# Altium project FE.PrjPcb
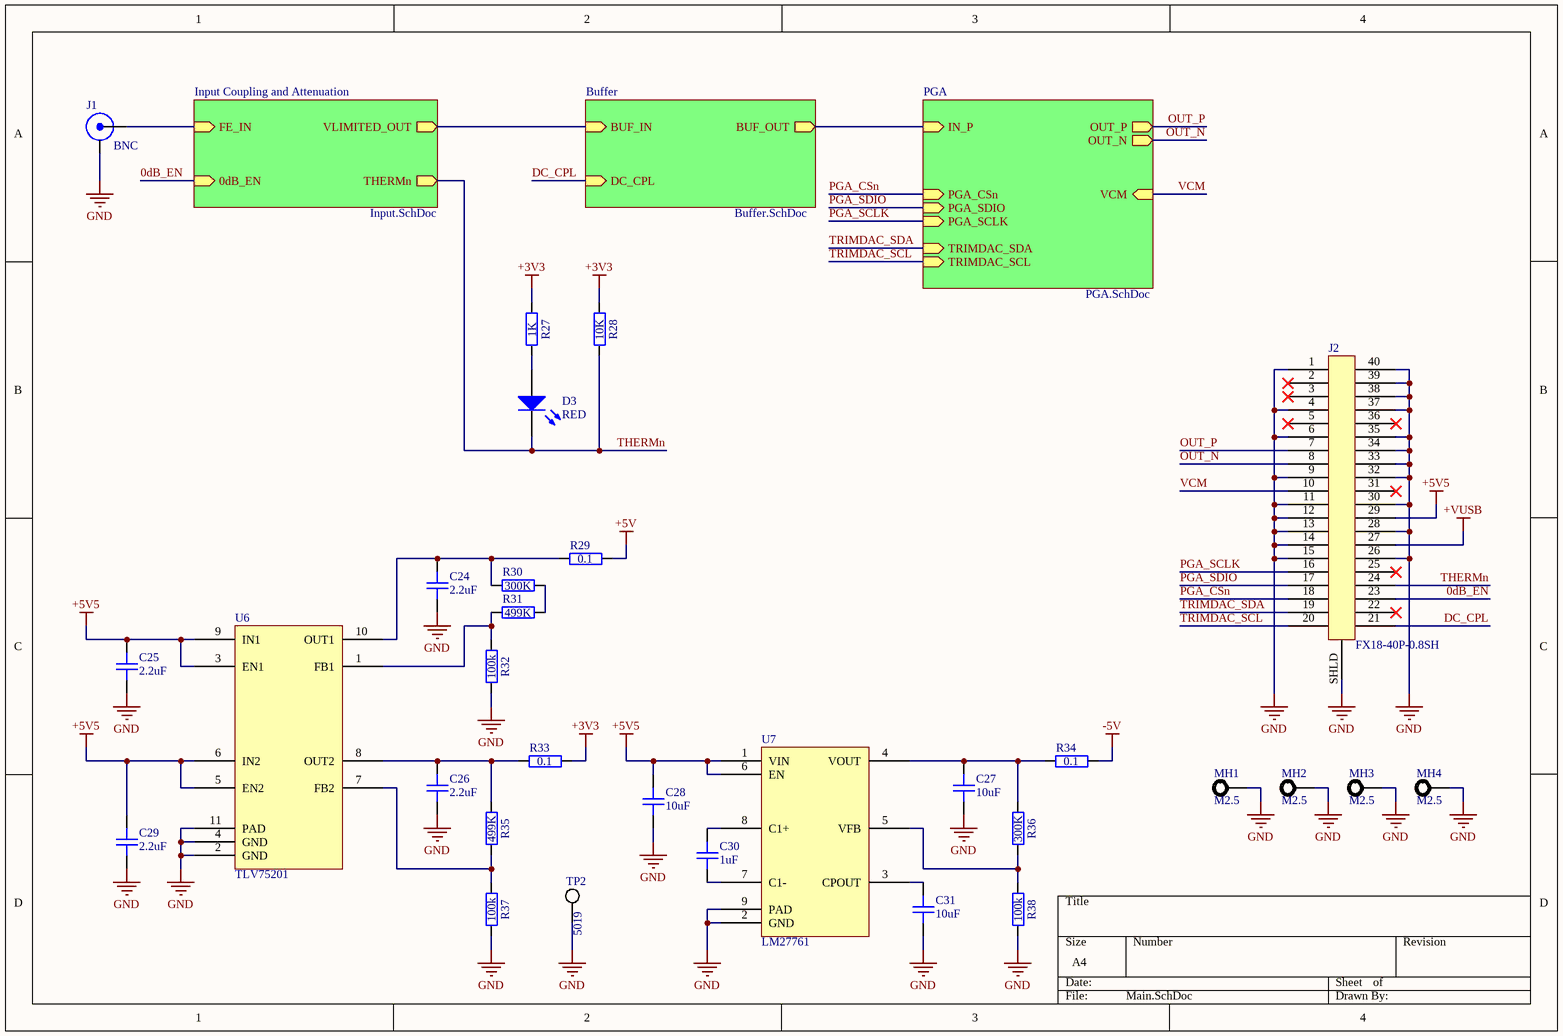
[diagram p0: Main.SchDoc]
4 sheets, 117 parts. Net scope: hierarchical (ports join the sheet entries above them; power ports are global).
Board file: FE.PcbDoc
Sheets:
  Main.SchDoc
    Input Coupling and Attenuation = Input.SchDoc
    Buffer = Buffer.SchDoc
    PGA = PGA.SchDoc

## Sheet Main.SchDoc
size A4

### Parts
C24  value 2.2uF  [GEN_C_0402]  (hidden comment: CAP 2.2uF 10V X5R 0402)
C25  value 2.2uF  [GEN_C_0402]  (hidden comment: CAP 2.2uF 10V X5R 0402)
C26  value 2.2uF  [GEN_C_0402]  (hidden comment: CAP 2.2uF 10V X5R 0402)
C27  value 10uF  [GEN_C_0603]  (hidden comment: CAP 10uF 10V X5R 0603)
C28  value 10uF  [GEN_C_0603]  (hidden comment: CAP 10uF 10V X5R 0603)
C29  value 2.2uF  [GEN_C_0402]  (hidden comment: CAP 2.2uF 10V X5R 0402)
C30  value 1uF  [GEN_C_0402]  (hidden comment: CAP 1uF 25V X5R 0402)
C31  value 10uF  [GEN_C_0603]  (hidden comment: CAP 10uF 10V X5R 0603)
D3  RED  [LED_0603_APT1608]
J1  BNC  [MOL_0731000105]
J2  FX18-40P-0.8SH  [HIR_FX18-40P-0.8SH]
MH1  M2.5  [MH M2.5]  (no BOM)
MH2  M2.5  [MH M2.5]  (no BOM)
MH3  M2.5  [MH M2.5]  (no BOM)
MH4  M2.5  [MH M2.5]  (no BOM)
R27  value 1K  [GEN_R_0402]  (hidden comment: RES 1K OHM 1% 1/10W 0402)
R28  value 10K  [GEN_R_0402]  (hidden comment: RES 10K OHM 1% 1/10W 0402)
R29  0.1  [GEN_R_0402]
R30  value 300K  [GEN_R_0402]  (hidden comment: RES 300K OHM 1% 1/10W 0402)
R31  value 499K  [GEN_R_0402]  (hidden comment: RES 499K OHM 1% 1/10W 0402)
R32  value 100k  [GEN_R_0402]  (hidden comment: RES 100K OHM 1% 1/10W 0402)
R33  0.1  [GEN_R_0402]
R34  0.1  [GEN_R_0402]
R35  value 499K  [GEN_R_0402]  (hidden comment: RES 499K OHM 1% 1/10W 0402)
R36  value 300K  [GEN_R_0402]  (hidden comment: RES 300K OHM 1% 1/10W 0402)
R37  value 100k  [GEN_R_0402]  (hidden comment: RES 100K OHM 1% 1/10W 0402)
R38  value 100k  [GEN_R_0402]  (hidden comment: RES 100K OHM 1% 1/10W 0402)
TP2  5019  [KEY_5019]
U6  TLV75201  [TI_WSON10_DSQ0010A]
U7  LM27761  [TI_WSON8_DSG0008A]

### Sub-sheets
Buffer = Buffer.SchDoc: BUF_IN (in), BUF_OUT (out), DC_CPL (in)
Input Coupling and Attenuation = Input.SchDoc: 0dB_EN (in), FE_IN (in), VLIMITED_OUT (out), THERMn (out)
PGA = PGA.SchDoc: IN_P (in), OUT_N (out), PGA_SDIO (in), OUT_P (out), VCM (in), PGA_SCLK (in), PGA_CSn (in), TRIMDAC_SDA (in), TRIMDAC_SCL (in)

### Nets
+3V3: R27.1 R28.2 R33.2
+5V: R29.2
+5V5: C25.2 C28.2 C29.2 J2.29 U6.3(EN1) U6.5(EN2) U6.6(IN2) U6.9(IN1) U7.1(VIN) U7.6(EN)
+VUSB: J2.27
-5V: R34.2
GND: C24.1 C25.1 C26.1 C27.1 C28.1 C29.1 C31.1 J1.2(SHIELD) J2.1 J2.4 J2.6 J2.9 J2.11 J2.12 J2.13 J2.14 J2.15 J2.26 J2.28 J2.30 J2.32 J2.33 J2.34 J2.35 J2.37 J2.38 J2.39 J2.40 J2.SHLD MH1.1 MH2.1 MH3.1 MH4.1 R32.1 R37.1 R38.1 TP2.1 U6.2(GND) U6.4(GND) U6.11(PAD) U7.2(GND) U7.9(PAD)
0dB_EN: J2.23 ; sheet Input Coupling and Attenuation/0dB_EN
DC_CPL: J2.21 ; sheet Buffer/DC_CPL
OUT_N: J2.8 ; sheet PGA/OUT_N
OUT_P: J2.7 ; sheet PGA/OUT_P
PGA_CSn: J2.18 ; sheet PGA/PGA_CSn
PGA_SCLK: J2.16 ; sheet PGA/PGA_SCLK
PGA_SDIO: J2.17 ; sheet PGA/PGA_SDIO
THERMn: D3.1(K) J2.24 R28.1 ; sheet Input Coupling and Attenuation/THERMn
TRIMDAC_SCL: J2.20 ; sheet PGA/TRIMDAC_SCL
TRIMDAC_SDA: J2.19 ; sheet PGA/TRIMDAC_SDA
VCM: J2.10 ; sheet PGA/VCM
NetC11_2: sheet Input Coupling and Attenuation/VLIMITED_OUT, sheet Buffer/BUF_IN
NetC18_2: J1.1(Signal) ; sheet Input Coupling and Attenuation/FE_IN
NetC24_2: C24.2 R29.1 R30.2 U6.10(OUT1)
NetC26_2: C26.2 R33.1 R35.2 U6.8(OUT2)
NetC27_2: C27.2 R34.1 R36.2 U7.4(VOUT)
NetC30_1: C30.1 U7.7(C1-)
NetC30_2: C30.2 U7.8(C1+)
NetC31_2: C31.2 U7.3(CPOUT)
NetD3_2: D3.2(A) R27.2
NetQ1_2: sheet Buffer/BUF_OUT, sheet PGA/IN_P
NetR30_1: R30.1 R31.1
NetR31_2: R31.2 R32.2 U6.1(FB1)
NetR35_1: R35.1 R37.2 U6.7(FB2)
NetR36_1: R36.1 R38.2 U7.5(VFB)

Not connected (* = marked no-connect by the designer): J2 2* 3* 5* 22* 25* 31* 36*

### Library data of the parts
D3 = LED RED 0603 APT1608: Supplier 1: Digi-Key; Supplier Part Number 1: 754-1930-1-ND
J1 = BNC JACK R/A: Supplier 1: Digi-Key; Supplier Part Number 1: WM5524-ND
J2 = CONN HDR FX18-40P-0.8SH: Supplier 1: Digi-Key; Supplier Part Number 1: H11868-ND
MH1-MH4 = MH M2.5
R27 = RES 1K OHM 1% 1/10W 0402: Power Rating: 0.1W; Tolerance: 1%; Package: 0402; Supplier 1: Digi-Key; Supplier Part Number 1: P1.00KLCT-ND
R28 = RES 10K OHM 1% 1/10W 0402: Power Rating: 0.1W; Tolerance: 1%; Package: 0402; Supplier 1: Digi-Key; Supplier Part Number 1: P10.0KLCT-ND
R29 R33 R34 = RES 0.1 OHM 1% 1/6W 0402: Tolerance: 1%; Power Rating: 0.16W; Package: 0402; Supplier 1: Digi-Key; Supplier Part Number 1: P.10AKCT-ND; Value: 0.1
R30 R36 = RES 300K OHM 1% 1/10W 0402: Power Rating: 0.1W; Tolerance: 1%; Package: 0402; Supplier 1: Digi-Key; Supplier Part Number 1: P300KLCT-ND
R31 R35 = RES 499K OHM 1% 1/10W 0402: Power Rating: 0.1W; Tolerance: 1%; Package: 0402; Supplier 1: Digi-Key; Supplier Part Number 1: P499KLCT-ND
R32 R37 R38 = RES 100K OHM 1% 1/10W 0402: Power Rating: 0.1W; Tolerance: 1%; Package: 0402; Supplier 1: Digi-Key; Supplier Part Number 1: P100KLCT-ND
TP2 = TP KEYSTONE 5019: Supplier 1: Digi-Key; Supplier Part Number 1: 36-5019CT-ND
U6 = IC LDO TLV75201: Supplier 1: Digi-Key; Supplier Part Number 1: 296-TLV75201PDSQRCT-ND
U7 = IC CPUMP LM27761: Supplier 1: Digi-Key; Supplier Part Number 1: 296-44379-1-ND
C24-C26 C29 = CAP 2.2uF 10V X5R 0402: Package: 0402; Voltage Rating: 10V; Supplier 1: Digi-Key; Supplier Part Number 1: 587-3153-1-ND
C27 C28 C31 = CAP 10uF 10V X5R 0603: Package: 0402; Voltage Rating: 10V; Supplier 1: Digi-Key; Supplier Part Number 1: 490-10474-1-ND
C30 = CAP 1uF 25V X5R 0402: Package: 0402; Voltage Rating: 25V; Supplier 1: Digi-Key; Supplier Part Number 1: 490-10017-1-ND

## Sheet Input.SchDoc
size A4
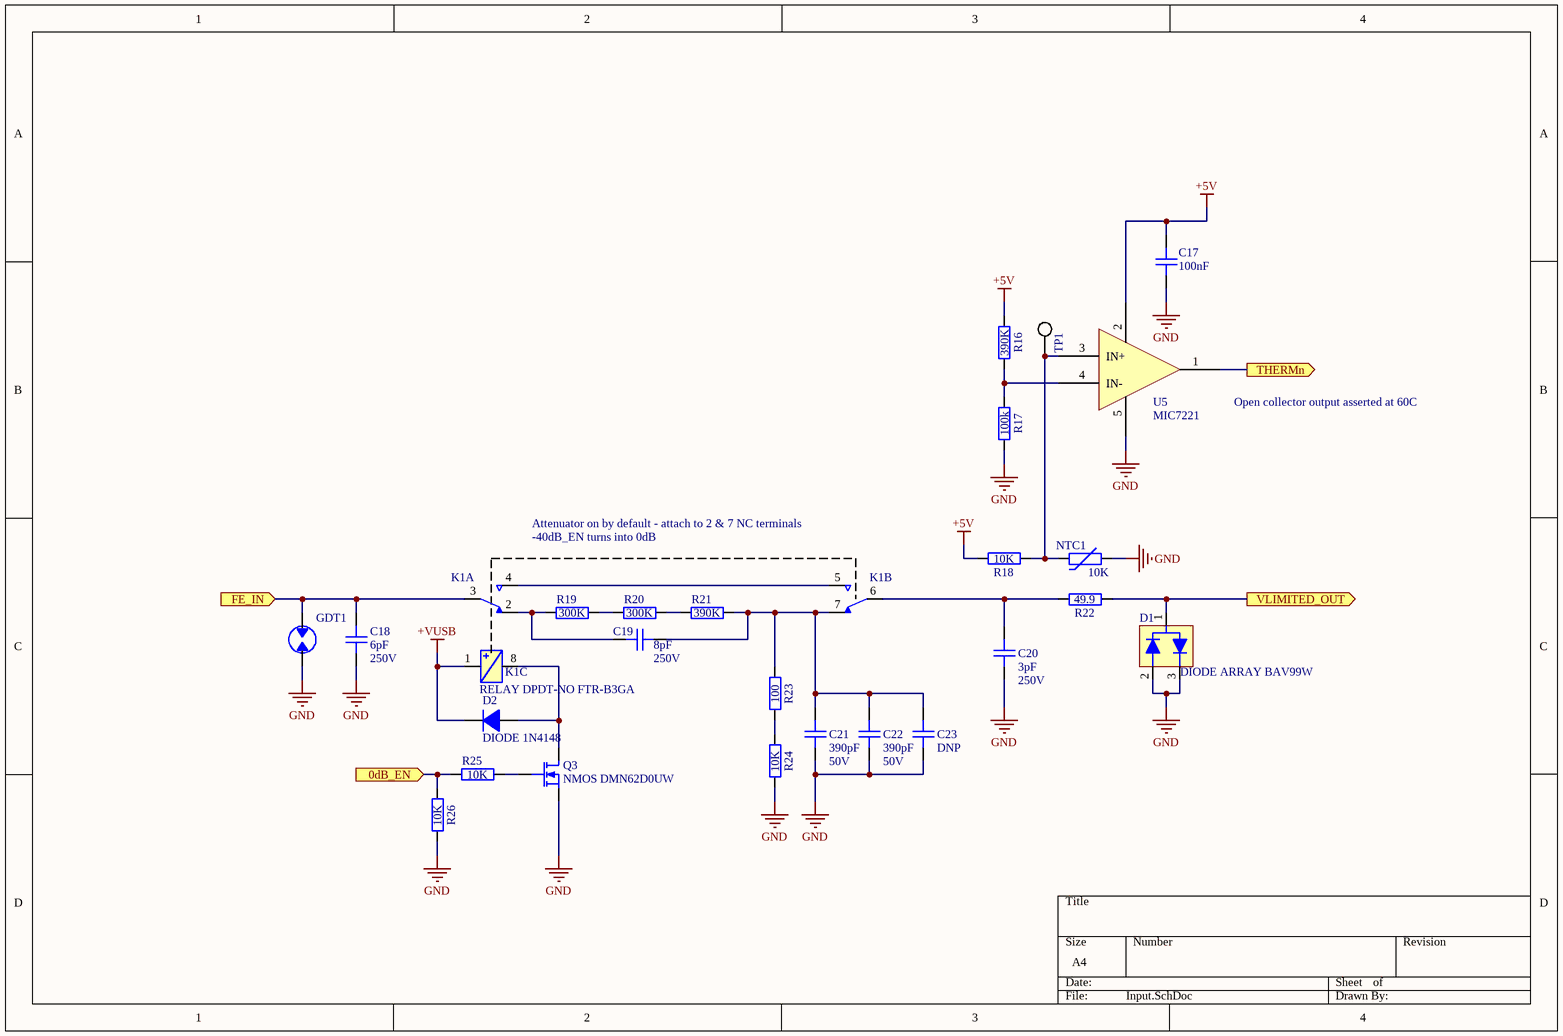
[diagram p1: Input.SchDoc]

### Parts
C17  value 100nF  [GEN_C_0402]  (hidden comment: CAP 100nF 16V X7R 0402)
C18  value 6pF  Voltage Rating: 250V  [GEN_C_0603]  (hidden comment: CAP 6pF 250V C0G 0603)
C19  value 8pF  Voltage Rating: 250V  [GEN_C_0603]  (hidden comment: CAP 8pF 250V C0G 0603)
C20  value 3pF  Voltage Rating: 250V  [GEN_C_0603]  (hidden comment: CAP 3pF 250V C0G 0603)
C21  value 390pF  Voltage Rating: 50V  [GEN_C_0402]  (hidden comment: CAP 390pF 50V C0G 0402)
C22  value 390pF  Voltage Rating: 50V  [GEN_C_0402]  (hidden comment: CAP 390pF 50V C0G 0402)
C23  value DNP  [GEN_C_0402]  (hidden comment: CAP DNP 0402)
D1  DIODE ARRAY BAV99W  [GEN_SOT_323]
D2  DIODE 1N4148  [GEN_SOD_323]
GDT1  GDT 90V  [BOU_2051]  (value not drawn)
K1  RELAY DPDT-NO FTR-B3GA  [FUJ_FTR-B3GA]  (value not drawn)  (parts A,B,C of 3)
NTC1  value 10K  [GEN_R_0402]  (hidden comment: NTC 10K 3900K 0402)
Q3  NMOS DMN62D0UW  [GEN_SOT_323]
R16  value 390K  [GEN_R_0402]  (hidden comment: RES 390K OHM 1% 1/10W 0402)
R17  value 100k  [GEN_R_0402]  (hidden comment: RES 100K OHM 1% 1/10W 0402)
R18  value 10K  [GEN_R_0402]  (hidden comment: RES 10K OHM 1% 1/10W 0402)
R19  value 300K  [GEN_R_0402]  (hidden comment: RES 300K OHM 1% 1/10W 0402)
R20  value 300K  [GEN_R_0402]  (hidden comment: RES 300K OHM 1% 1/10W 0402)
R21  value 390K  [GEN_R_0402]  (hidden comment: RES 390K OHM 1% 1/10W 0402)
R22  49.9  [GEN_R_0402]
R23  value 100  [GEN_R_0402]  (hidden comment: RES 100 OHM 1% 1/10W 0402)
R24  value 10K  [GEN_R_0402]  (hidden comment: RES 10K OHM 1% 1/10W 0402)
R25  value 10K  [GEN_R_0402]  (hidden comment: RES 10K OHM 1% 1/10W 0402)
R26  value 10K  [GEN_R_0402]  (hidden comment: RES 10K OHM 1% 1/10W 0402)
TP1  5019  [KEY_5019]  (value not drawn)
U5  MIC7221  [GEN_SOT23_5_950_2900X1600X1450]

### Ports
0dB_EN (in), FE_IN (in), THERMn (out), VLIMITED_OUT (out)

### Nets
+5V: C17.1 R16.1 R18.2 U5.2(V+)
+VUSB: D2.1(K) K1.1
GND: C17.2 C18.1 C20.2 C21.1 C22.1 C23.1 D1.2 D1.3 GDT1.2 NTC1.2 Q3.3(S) R17.2 R24.1 R26.1 U5.5(V-)
0dB_EN: R25.2 R26.2 ; port 0dB_EN
THERMn: U5.1(OUT) ; port THERMn
NetC11_2: D1.1 R22.2 ; port VLIMITED_OUT
NetC18_2: C18.2 GDT1.1 K1.3 ; port FE_IN
NetC19_1: C19.1 C21.2 C22.2 C23.2 K1.7 R21.2 R23.2
NetC19_2: C19.2 K1.2 R19.1
NetC20_1: C20.1 K1.6 R22.1
NetD2_2: D2.2(A) K1.8 Q3.1(D)
NetK1_4: K1.4 K1.5
NetNTC1_1: NTC1.1 R18.1 TP1.1 U5.3(IN+)
NetQ3_2: Q3.2(G) R25.1
NetR16_2: R16.2 R17.1 U5.4(IN-)
NetR19_2: R19.2 R20.1
NetR20_2: R20.2 R21.1
NetR23_1: R23.1 R24.2

### Notes on the sheet
- Open collector output asserted at 60C
- Attenuator on by default - attach to 2 & 7 NC terminals
- -40dB_EN turns into 0dB

### Library data of the parts
D2 = DIODE 1N4148: Max Reverse Voltage: 75V; Max Current: 150mA; Supplier 1: Digi-Key; Supplier Part Number 1: 1N4148WS-FDICT-ND
Q3 = NMOS DMN62D0UW: Vdss: 60V; Id: 340mA; Max Power: 320mW; Supplier 1: Digi-Key; Supplier Part Number 1: DMN62D0UW-7DICT-ND
R16 R21 = RES 390K OHM 1% 1/10W 0402: Power Rating: 0.1W; Tolerance: 1%; Package: 0402; Supplier 1: Digi-Key; Supplier Part Number 1: P390KLCT-ND
R17 = RES 100K OHM 1% 1/10W 0402: Power Rating: 0.1W; Tolerance: 1%; Package: 0402; Supplier 1: Digi-Key; Supplier Part Number 1: P100KLCT-ND
R18 R24-R26 = RES 10K OHM 1% 1/10W 0402: Power Rating: 0.1W; Tolerance: 1%; Package: 0402; Supplier 1: Digi-Key; Supplier Part Number 1: P10.0KLCT-ND
R19 R20 = RES 300K OHM 1% 1/10W 0402: Power Rating: 0.1W; Tolerance: 1%; Package: 0402; Supplier 1: Digi-Key; Supplier Part Number 1: P300KLCT-ND
R22 = RES 49.9 OHM 1% 1/10W 0402: Tolerance: 1%; Power Rating: 0.1W; Package: 0402; Supplier 1: Digi-Key; Supplier Part Number 1: P49.9LCT-ND; Value: 49.9
R23 = RES 100 OHM 1% 1/10W 0402: Power Rating: 0.1W; Tolerance: 1%; Package: 0402; Supplier 1: Digi-Key; Supplier Part Number 1: P100LCT-ND
TP1 = TP KEYSTONE 5019: Supplier 1: Digi-Key; Supplier Part Number 1: 36-5019CT-ND
U5 = IC COMP MIC7221YM5: Supplier 1: Digi-Key; Supplier Part Number 1: 576-2901-1-ND
C17 = CAP 100nF 16V X7R 0402: Package: 0402; Voltage Rating: 16V; Supplier 1: Digi-Key; Supplier Part Number 1: 490-4759-1-ND
C18 = CAP 6pF 250V C0G 0603: Supplier 1: Digi-Key; Supplier Part Number 1: 399-8734-1-ND; Package: 0603
C19 = CAP 8pF 250V C0G 0603: Package: 0603; Supplier 1: Digi-Key; Supplier Part Number 1: 399-8740-1-ND
C20 = CAP 3pF 250V C0G 0603: Package: 0603; Supplier 1: Digi-Key; Supplier Part Number 1: 399-8820-1-ND
C21 C22 = CAP 390pF 50V C0G 0402: Package: 0402; Supplier 1: Digi-Key; Supplier Part Number 1: 490-8202-1-ND
C23 = CAP DNP 0402: Package: 0402
D1 = DIODE ARRAY BAV99W: Supplier 1: Digi-Key; Supplier Part Number 1: BAV99W-FDICT-ND
GDT1 = GDT 90V: Supplier 1: Digi-Key; Supplier Part Number 1: 2051-09-SM-RPLFCT-ND
NTC1 = NTC 10K 3900K 0402: Package: 0402; B Value: 3900k; Supplier 1: Digi-Key; Supplier Part Number 1: P12985CT-ND

## Sheet Buffer.SchDoc
size A4
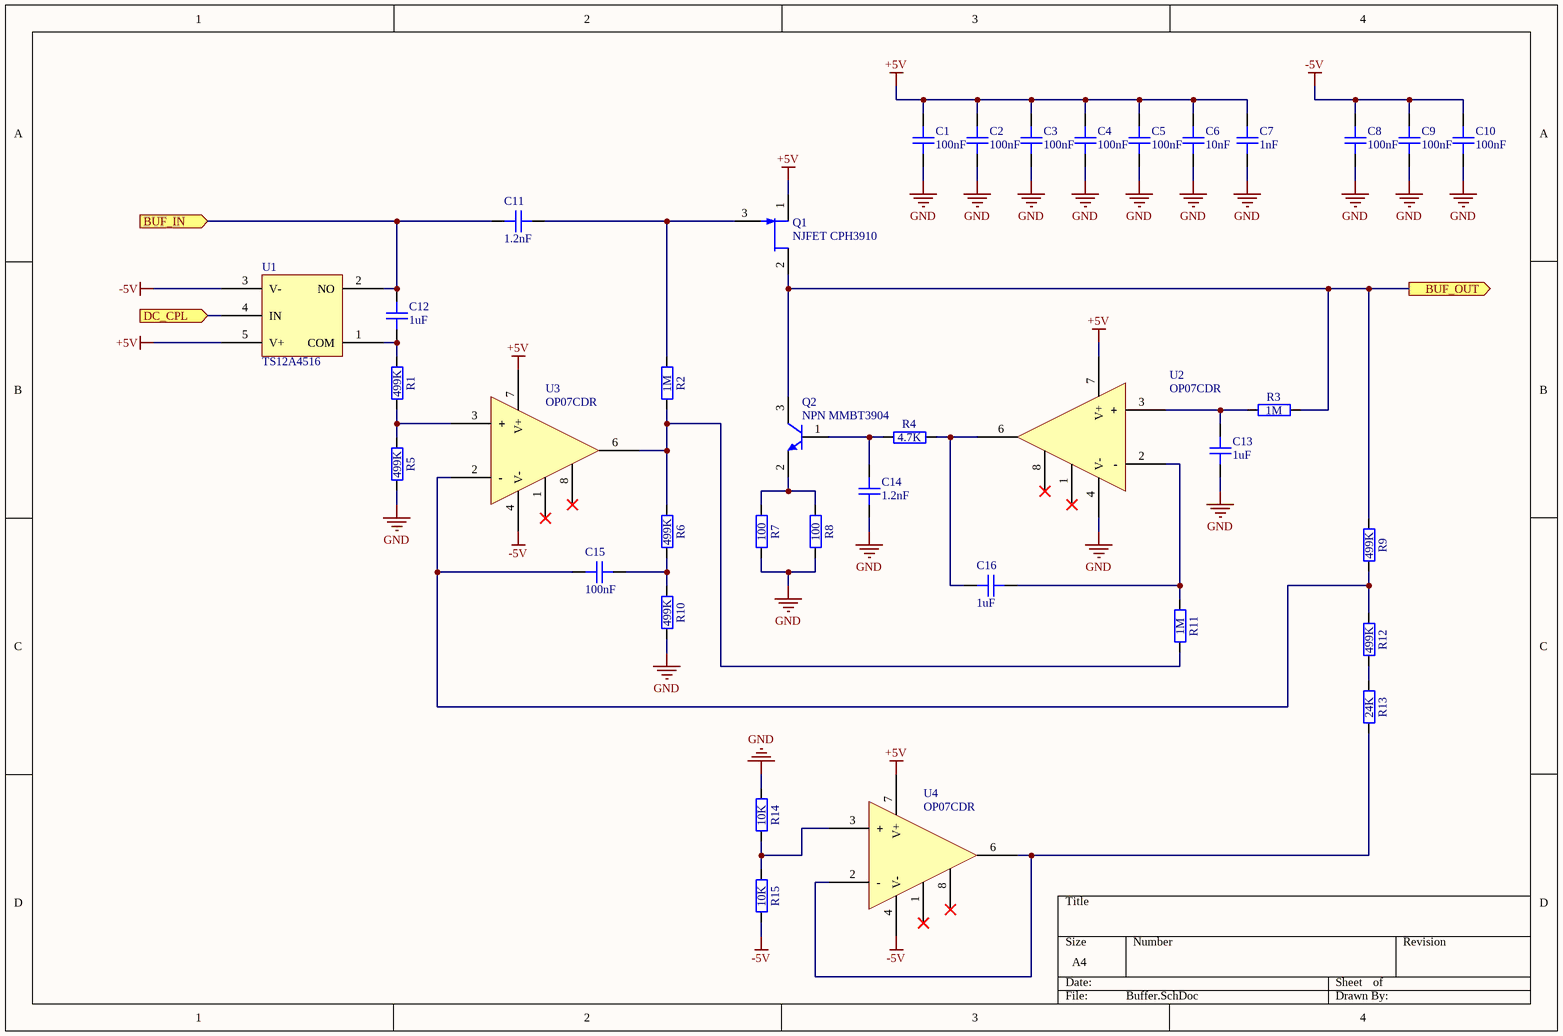
[diagram p2: Buffer.SchDoc]

### Parts
C1  value 100nF  [GEN_C_0402]  (hidden comment: CAP 100nF 16V X7R 0402)
C2  value 100nF  [GEN_C_0402]  (hidden comment: CAP 100nF 16V X7R 0402)
C3  value 100nF  [GEN_C_0402]  (hidden comment: CAP 100nF 16V X7R 0402)
C4  value 100nF  [GEN_C_0402]  (hidden comment: CAP 100nF 16V X7R 0402)
C5  value 100nF  [GEN_C_0402]  (hidden comment: CAP 100nF 16V X7R 0402)
C6  value 10nF  [GEN_C_0402]  (hidden comment: CAP 10nF 50V X7R 0402)
C7  value 1nF  [GEN_C_0402]  (hidden comment: CAP 1nF 50V X7R 0402)
C8  value 100nF  [GEN_C_0402]  (hidden comment: CAP 100nF 16V X7R 0402)
C9  value 100nF  [GEN_C_0402]  (hidden comment: CAP 100nF 16V X7R 0402)
C10  value 100nF  [GEN_C_0402]  (hidden comment: CAP 100nF 16V X7R 0402)
C11  1.2nF  [GEN_C_0603]
C12  value 1uF  [GEN_C_0402]  (hidden comment: CAP 1uF 25V X5R 0402)
C13  value 1uF  [GEN_C_0402]  (hidden comment: CAP 1uF 25V X5R 0402)
C14  1.2nF  [GEN_C_0603]
C15  value 100nF  [GEN_C_0402]  (hidden comment: CAP 100nF 16V X7R 0402)
C16  value 1uF  [GEN_C_0402]  (hidden comment: CAP 1uF 25V X5R 0402)
Q1  NJFET CPH3910  [ON_SOT23_CPH3]
Q2  NPN MMBT3904  [MMC_SOT23]
R1  value 499K  [GEN_R_0402]  (hidden comment: RES 499K OHM 1% 1/10W 0402)
R2  value 1M  [GEN_R_0402]  (hidden comment: RES 1M OHM 1% 1/10W 0402)
R3  value 1M  [GEN_R_0402]  (hidden comment: RES 1M OHM 1% 1/10W 0402)
R4  value 4.7K  [GEN_R_0402]  (hidden comment: RES 4.7K OHM 1% 1/10W 0402)
R5  value 499K  [GEN_R_0402]  (hidden comment: RES 499K OHM 1% 1/10W 0402)
R6  value 499K  [GEN_R_0402]  (hidden comment: RES 499K OHM 1% 1/10W 0402)
R7  value 100  [GEN_R_0402]  (hidden comment: RES 100 OHM 1% 1/10W 0402)
R8  value 100  [GEN_R_0402]  (hidden comment: RES 100 OHM 1% 1/10W 0402)
R9  value 499K  [GEN_R_0402]  (hidden comment: RES 499K OHM 1% 1/10W 0402)
R10  value 499K  [GEN_R_0402]  (hidden comment: RES 499K OHM 1% 1/10W 0402)
R11  value 1M  [GEN_R_0402]  (hidden comment: RES 1M OHM 1% 1/10W 0402)
R12  value 499K  [GEN_R_0402]  (hidden comment: RES 499K OHM 1% 1/10W 0402)
R13  value 24K  [GEN_R_0402]  (hidden comment: RES 24K OHM 1% 1/10W 0402)
R14  value 10K  [GEN_R_0402]  (hidden comment: RES 10K OHM 1% 1/10W 0402)
R15  value 10K  [GEN_R_0402]  (hidden comment: RES 10K OHM 1% 1/10W 0402)
U1  TS12A4516  [GEN_SOT23_5_950_2900X1600X1450]
U2  OP07CDR  [TI_SOIC8_D0008A]
U3  OP07CDR  [TI_SOIC8_D0008A]
U4  OP07CDR  [TI_SOIC8_D0008A]

### Ports
BUF_IN (in), BUF_OUT (out), DC_CPL (in)

### Nets
+5V: C1.1 C2.1 C3.1 C4.1 C5.1 C6.2 C7.2 Q1.1(S) U1.5(V+) U2.7(V+) U3.7(V+) U4.7(V+)
-5V: C8.1 C9.1 C10.1 R15.1 U1.3(V-) U3.4(V-) U4.4(V-)
GND: C1.2 C2.2 C3.2 C4.2 C5.2 C6.1 C7.1 C8.2 C9.2 C10.2 C13.1 C14.1 R5.1 R7.1 R8.1 R10.1 R14.2 U2.4(V-)
DC_CPL: U1.4(IN) ; port DC_CPL
NetC11_1: C11.1 Q1.3(G) R2.2
NetC11_2: C11.2 C12.2 U1.2(NO) ; port BUF_IN
NetC12_1: C12.1 R1.2 U1.1(COM)
NetC13_2: C13.2 R3.2 U2.3(+)
NetC14_2: C14.2 Q2.1(B) R4.1
NetC15_1: C15.1 R6.1 R10.2
NetC15_2: C15.2 R9.1 R12.2 U3.2(-)
NetC16_1: C16.1 R11.2 U2.2(-)
NetC16_2: C16.2 R4.2 U2.6(OUT)
NetQ1_2: Q1.2(D) Q2.3(C) R3.1 R9.2 ; port BUF_OUT
NetQ2_2: Q2.2(E) R7.2 R8.2
NetR1_1: R1.1 R5.2 U3.3(+)
NetR2_1: R2.1 R6.2 R11.1 U3.6(OUT)
NetR12_1: R12.1 R13.2
NetR13_1: R13.1 U4.2(-) U4.6(OUT)
NetR14_1: R14.1 R15.2 U4.3(+)

Not connected (* = marked no-connect by the designer): U2 1(N1)* 8(N2)*; U3 1(N1)* 8(N2)*; U4 1(N1)* 8(N2)*

### Library data of the parts
C11 C14 = CAP 1.2nF 50V C0G 0603: Voltage Rating: 50V; Temperature Coefficient: C0G; Package: 0603; Value: 1.2nF; Supplier 1: Digi-Key; Supplier Part Number 1: 490-1453-1-ND
R1 R5 R6 R9 R10 R12 = RES 499K OHM 1% 1/10W 0402: Power Rating: 0.1W; Tolerance: 1%; Package: 0402; Supplier 1: Digi-Key; Supplier Part Number 1: P499KLCT-ND
R2 R3 R11 = RES 1M OHM 1% 1/10W 0402: Power Rating: 0.1W; Tolerance: 1%; Package: 0402; Supplier 1: Digi-Key; Supplier Part Number 1: P1.00MLCT-ND
R4 = RES 4.7K OHM 1% 1/10W 0402: Power Rating: 0.1W; Tolerance: 1%; Package: 0402; Supplier 1: Digi-Key; Supplier Part Number 1: P4.70KLCT-ND
R7 R8 = RES 100 OHM 1% 1/10W 0402: Power Rating: 0.1W; Tolerance: 1%; Package: 0402; Supplier 1: Digi-Key; Supplier Part Number 1: P100LCT-ND
R13 = RES 24K OHM 1% 1/10W 0402: Power Rating: 0.1W; Tolerance: 1%; Package: 0402; Supplier 1: Digi-Key; Supplier Part Number 1: P24.0KLCT-ND
R14 R15 = RES 10K OHM 1% 1/10W 0402: Power Rating: 0.1W; Tolerance: 1%; Package: 0402; Supplier 1: Digi-Key; Supplier Part Number 1: P10.0KLCT-ND
U1 = IC SWITCH SPST TS12A4516DBVR: Supplier 1: Digi-Key; Supplier Part Number 1: 296-24269-1-ND
U2-U4 = IC OPAMP OP07CDR: Supplier 1: Digi-Key; Supplier Part Number 1: 296-14626-1-ND
C1-C5 C8-C10 C15 = CAP 100nF 16V X7R 0402: Package: 0402; Voltage Rating: 16V; Supplier 1: Digi-Key; Supplier Part Number 1: 490-4759-1-ND
C6 = CAP 10nF 50V X7R 0402: Package: 0402; Voltage Rating: 50V; Supplier 1: Digi-Key; Supplier Part Number 1: 490-4762-1-ND
C7 = CAP 1nF 50V X7R 0402: Package: 0402; Voltage Rating: 50V; Supplier 1: Digi-Key; Supplier Part Number 1: 490-4761-1-ND
C12 C13 C16 = CAP 1uF 25V X5R 0402: Package: 0402; Voltage Rating: 25V; Supplier 1: Digi-Key; Supplier Part Number 1: 490-10017-1-ND
Q1 = NJFET CPH3910: Supplier 1: Digi-Key; Supplier Part Number 1: CPH3910-TL-EOSCT-ND
Q2 = NPN MMBT3904: Supplier 1: Digi-Key; Supplier Part Number 1: MMBT3904TPMSCT-ND

## Sheet PGA.SchDoc
size A4
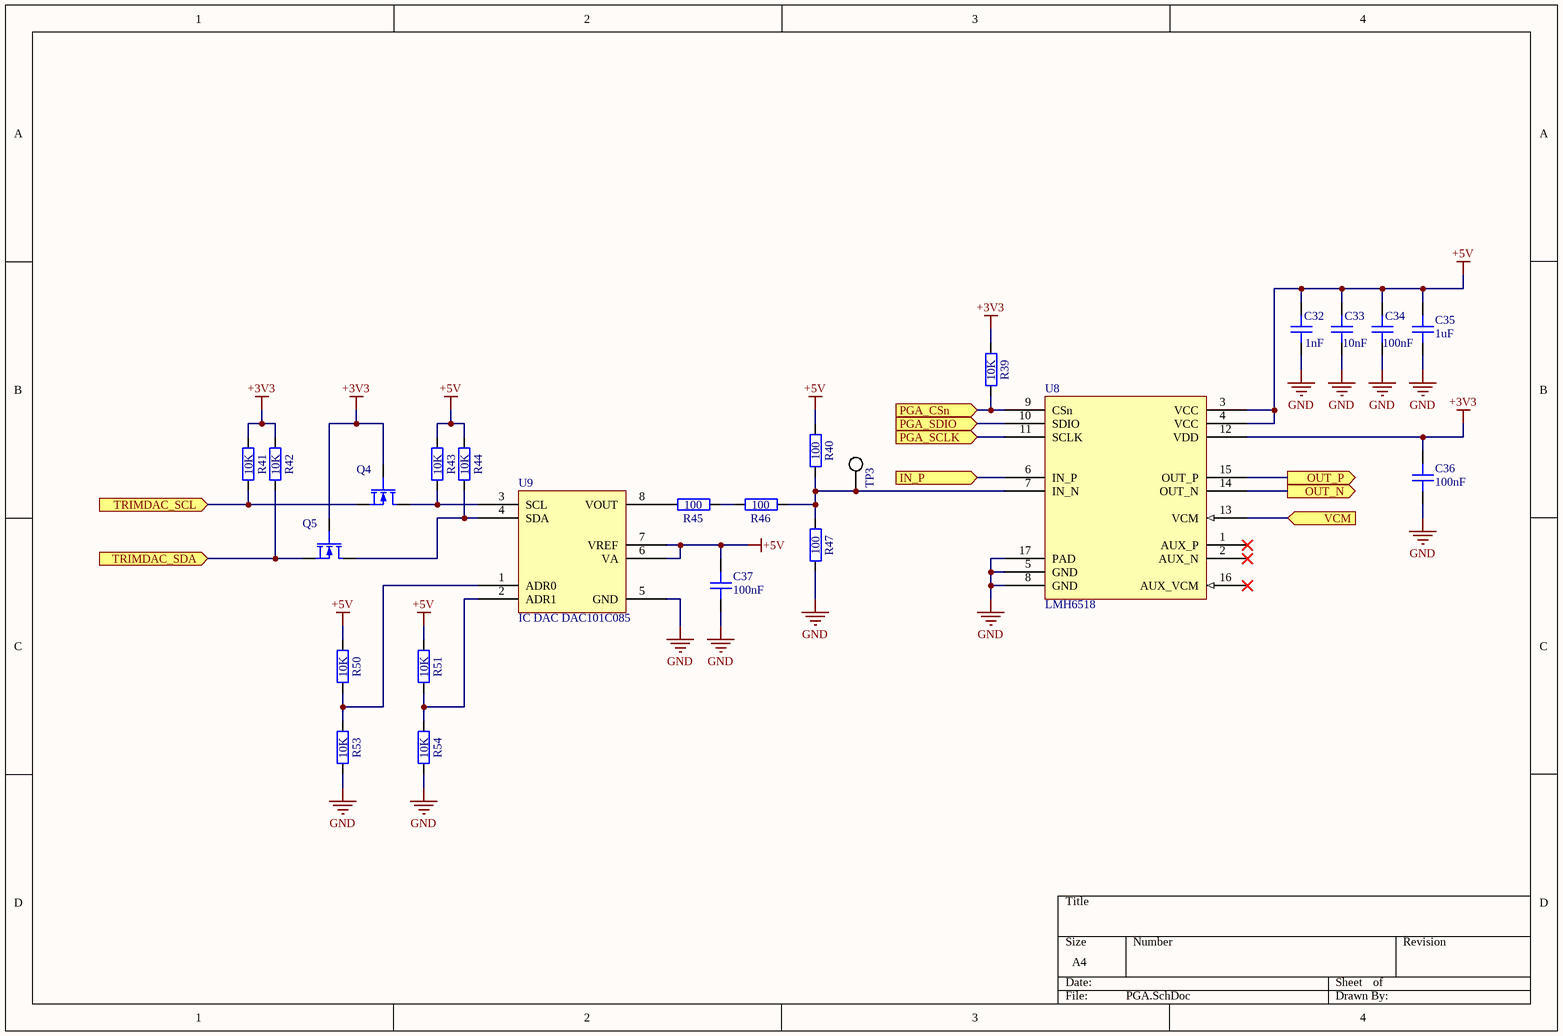
[diagram p3: PGA.SchDoc]

### Parts
C32  value 1nF  [GEN_C_0402]  (hidden comment: CAP 1nF 50V X7R 0402)
C33  value 10nF  [GEN_C_0402]  (hidden comment: CAP 10nF 50V X7R 0402)
C34  value 100nF  [GEN_C_0402]  (hidden comment: CAP 100nF 16V X7R 0402)
C35  value 1uF  [GEN_C_0402]  (hidden comment: CAP 1uF 25V X5R 0402)
C36  value 100nF  [GEN_C_0402]  (hidden comment: CAP 100nF 16V X7R 0402)
C37  value 100nF  [GEN_C_0402]  (hidden comment: CAP 100nF 16V X7R 0402)
Q4  NMOS DMN62D0UW  [GEN_SOT_323]  (value not drawn)
Q5  NMOS DMN62D0UW  [GEN_SOT_323]  (value not drawn)
R39  value 10K  [GEN_R_0402]  (hidden comment: RES 10K OHM 1% 1/10W 0402)
R40  value 100  [GEN_R_0402]  (hidden comment: RES 100 OHM 1% 1/10W 0402)
R41  value 10K  [GEN_R_0402]  (hidden comment: RES 10K OHM 1% 1/10W 0402)
R42  value 10K  [GEN_R_0402]  (hidden comment: RES 10K OHM 1% 1/10W 0402)
R43  value 10K  [GEN_R_0402]  (hidden comment: RES 10K OHM 1% 1/10W 0402)
R44  value 10K  [GEN_R_0402]  (hidden comment: RES 10K OHM 1% 1/10W 0402)
R45  value 100  [GEN_R_0402]  (hidden comment: RES 100 OHM 1% 1/10W 0402)
R46  value 100  [GEN_R_0402]  (hidden comment: RES 100 OHM 1% 1/10W 0402)
R47  value 100  [GEN_R_0402]  (hidden comment: RES 100 OHM 1% 1/10W 0402)
R50  value 10K  [GEN_R_0402]  (hidden comment: RES 10K OHM 1% 1/10W 0402)
R51  value 10K  [GEN_R_0402]  (hidden comment: RES 10K OHM 1% 1/10W 0402)
R53  value 10K  [GEN_R_0402]  (hidden comment: RES 10K OHM 1% 1/10W 0402)
R54  value 10K  [GEN_R_0402]  (hidden comment: RES 10K OHM 1% 1/10W 0402)
TP3  5019  [KEY_5019]  (value not drawn)
U8  LMH6518  [TI_WQFN_RGH0016A]
U9  IC DAC DAC101C085  [TI_VSSOP8_DGK]

### Ports
IN_P (in), OUT_N (out), OUT_P (out), PGA_CSn (in), PGA_SCLK (in), PGA_SDIO (in), TRIMDAC_SCL (in), TRIMDAC_SDA (in), VCM (in)

### Nets
+3V3: C36.2 Q4.2(G) Q5.2(G) R39.2 R41.2 R42.2 U8.12(VDD)
+5V: C32.2 C33.2 C34.2 C35.2 C37.2 R40.2 R43.2 R44.2 R50.2 R51.2 U8.3(VCC) U8.4(VCC) U9.6(VA) U9.7(VREF)
GND: C32.1 C33.1 C34.1 C35.1 C36.1 C37.1 R47.1 R53.1 R54.1 U8.5(GND) U8.8(GND) U8.17(PAD) U9.5(GND)
OUT_N: U8.14(OUT_N) ; port OUT_N
OUT_P: U8.15(OUT_P) ; port OUT_P
PGA_CSn: R39.1 U8.9(CSn) ; port PGA_CSn
PGA_SCLK: U8.11(SCLK) ; port PGA_SCLK
PGA_SDIO: U8.10(SDIO) ; port PGA_SDIO
TRIMDAC_SCL: Q4.3(S) R41.1 ; port TRIMDAC_SCL
TRIMDAC_SDA: Q5.3(S) R42.1 ; port TRIMDAC_SDA
VCM: U8.13(VCM) ; port VCM
NetQ1_2: U8.6(IN_P) ; port IN_P
NetQ4_1: Q4.1(D) R43.1 U9.3(SCL)
NetQ5_1: Q5.1(D) R44.1 U9.4(SDA)
NetR40_1: R40.1 R46.1 R47.2 TP3.1 U8.7(IN_N)
NetR45_1: R45.1 R46.2
NetR45_2: R45.2 U9.8(VOUT)
NetR50_1: R50.1 R53.2 U9.1(ADR0)
NetR51_1: R51.1 R54.2 U9.2(ADR1)

Not connected (* = marked no-connect by the designer): U8 1(AUX_P)* 2(AUX_N)* 16(AUX_VCM)*

### Library data of the parts
Q4 Q5 = NMOS DMN62D0UW: Vdss: 60V; Id: 340mA; Max Power: 320mW; Supplier 1: Digi-Key; Supplier Part Number 1: DMN62D0UW-7DICT-ND
R39 R41-R44 R50 R51 R53 R54 = RES 10K OHM 1% 1/10W 0402: Power Rating: 0.1W; Tolerance: 1%; Package: 0402; Supplier 1: Digi-Key; Supplier Part Number 1: P10.0KLCT-ND
R40 R45-R47 = RES 100 OHM 1% 1/10W 0402: Power Rating: 0.1W; Tolerance: 1%; Package: 0402; Supplier 1: Digi-Key; Supplier Part Number 1: P100LCT-ND
TP3 = TP KEYSTONE 5019: Supplier 1: Digi-Key; Supplier Part Number 1: 36-5019CT-ND
U8 = IC PGA LMH6518: Supplier 1: Digi-Key; Supplier Part Number 1: LMH6518SQE/NOPBCT-ND
C32 = CAP 1nF 50V X7R 0402: Package: 0402; Voltage Rating: 50V; Supplier 1: Digi-Key; Supplier Part Number 1: 490-4761-1-ND
C33 = CAP 10nF 50V X7R 0402: Package: 0402; Voltage Rating: 50V; Supplier 1: Digi-Key; Supplier Part Number 1: 490-4762-1-ND
C34 C36 C37 = CAP 100nF 16V X7R 0402: Package: 0402; Voltage Rating: 16V; Supplier 1: Digi-Key; Supplier Part Number 1: 490-4759-1-ND
C35 = CAP 1uF 25V X5R 0402: Package: 0402; Voltage Rating: 25V; Supplier 1: Digi-Key; Supplier Part Number 1: 490-10017-1-ND
U9 = IC DAC DAC101C085: Supplier 1: Digi-Key; Supplier Part Number 1: DAC101C085CIMM/NOPBCT-ND

## Nets that join several sheets
+3V3: Main (R27.1 R28.2 R33.2), PGA (7 pins)
+5V: Main (R29.2), Input (C17.1 R16.1 R18.2 U5.2), Buffer (12 pins), PGA (14 pins)
+VUSB: Main (J2.27), Input (D2.1 K1.1)
-5V: Main (R34.2), Buffer (7 pins)
GND: Main (42 pins), Input (15 pins), Buffer (18 pins), PGA (13 pins)
0dB_EN: Main (J2.23), Input (R25.2 R26.2)
DC_CPL: Main (J2.21), Buffer (U1.4)
NetC11_2: Input (D1.1 R22.2), Buffer (C11.2 C12.2 U1.2)
NetC18_2: Main (J1.1), Input (C18.2 GDT1.1 K1.3)
NetQ1_2: Buffer (Q1.2 Q2.3 R3.1 R9.2), PGA (U8.6)
OUT_N: Main (J2.8), PGA (U8.14)
OUT_P: Main (J2.7), PGA (U8.15)
PGA_CSn: Main (J2.18), PGA (R39.1 U8.9)
PGA_SCLK: Main (J2.16), PGA (U8.11)
PGA_SDIO: Main (J2.17), PGA (U8.10)
THERMn: Main (D3.1 J2.24 R28.1), Input (U5.1)
TRIMDAC_SCL: Main (J2.20), PGA (Q4.3 R41.1)
TRIMDAC_SDA: Main (J2.19), PGA (Q5.3 R42.1)
VCM: Main (J2.10), PGA (U8.13)

## Assembly variants
Dev_CH4: not fitted C23 R50 R51 R53 R54